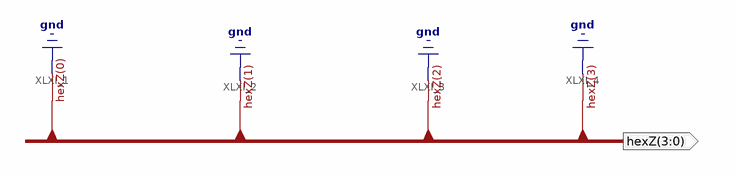
[diagram p0: schematic sheet 1]
// Xilinx ISE schematic HEXzero.sch (spartan3e) as structural Verilog: 0 symbols, 1 ports
module HEXzero (
  output [3:0] hexZ
);


  assign hexZ = 4'b0000;
endmodule
